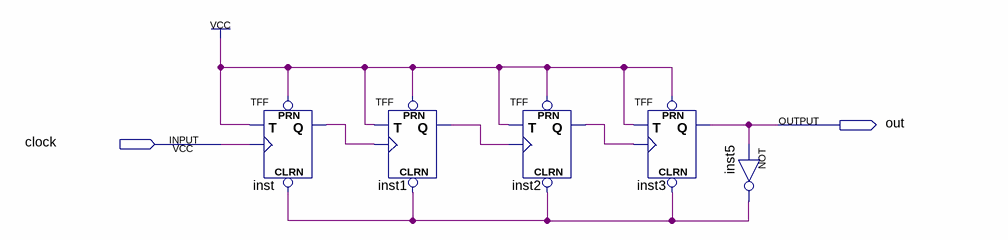
[diagram p0: schematic sheet]
// Quartus schematic freqDiminisher.bdf as structural Verilog: 5 symbols, 2 pins
module freqDiminisher (
  input  clock,
  output out
);

  wire inst1_q, inst2_q, inst5_out, inst_q;

  TFF inst (.PRN(1'b1), .CLRN(inst5_out), .T(1'b1), .CLK(clock), .Q(inst_q));
  TFF inst1 (.PRN(1'b1), .CLRN(inst5_out), .T(1'b1), .CLK(inst_q), .Q(inst1_q));
  TFF inst2 (.PRN(1'b1), .CLRN(inst5_out), .T(1'b1), .CLK(inst1_q), .Q(inst2_q));
  TFF inst3 (.PRN(1'b1), .CLRN(inst5_out), .T(1'b1), .CLK(inst2_q), .Q(out));
  not inst5 (inst5_out, out);
endmodule
